# EAGLE design CanBus25mar (EAGLE 7.6.0)
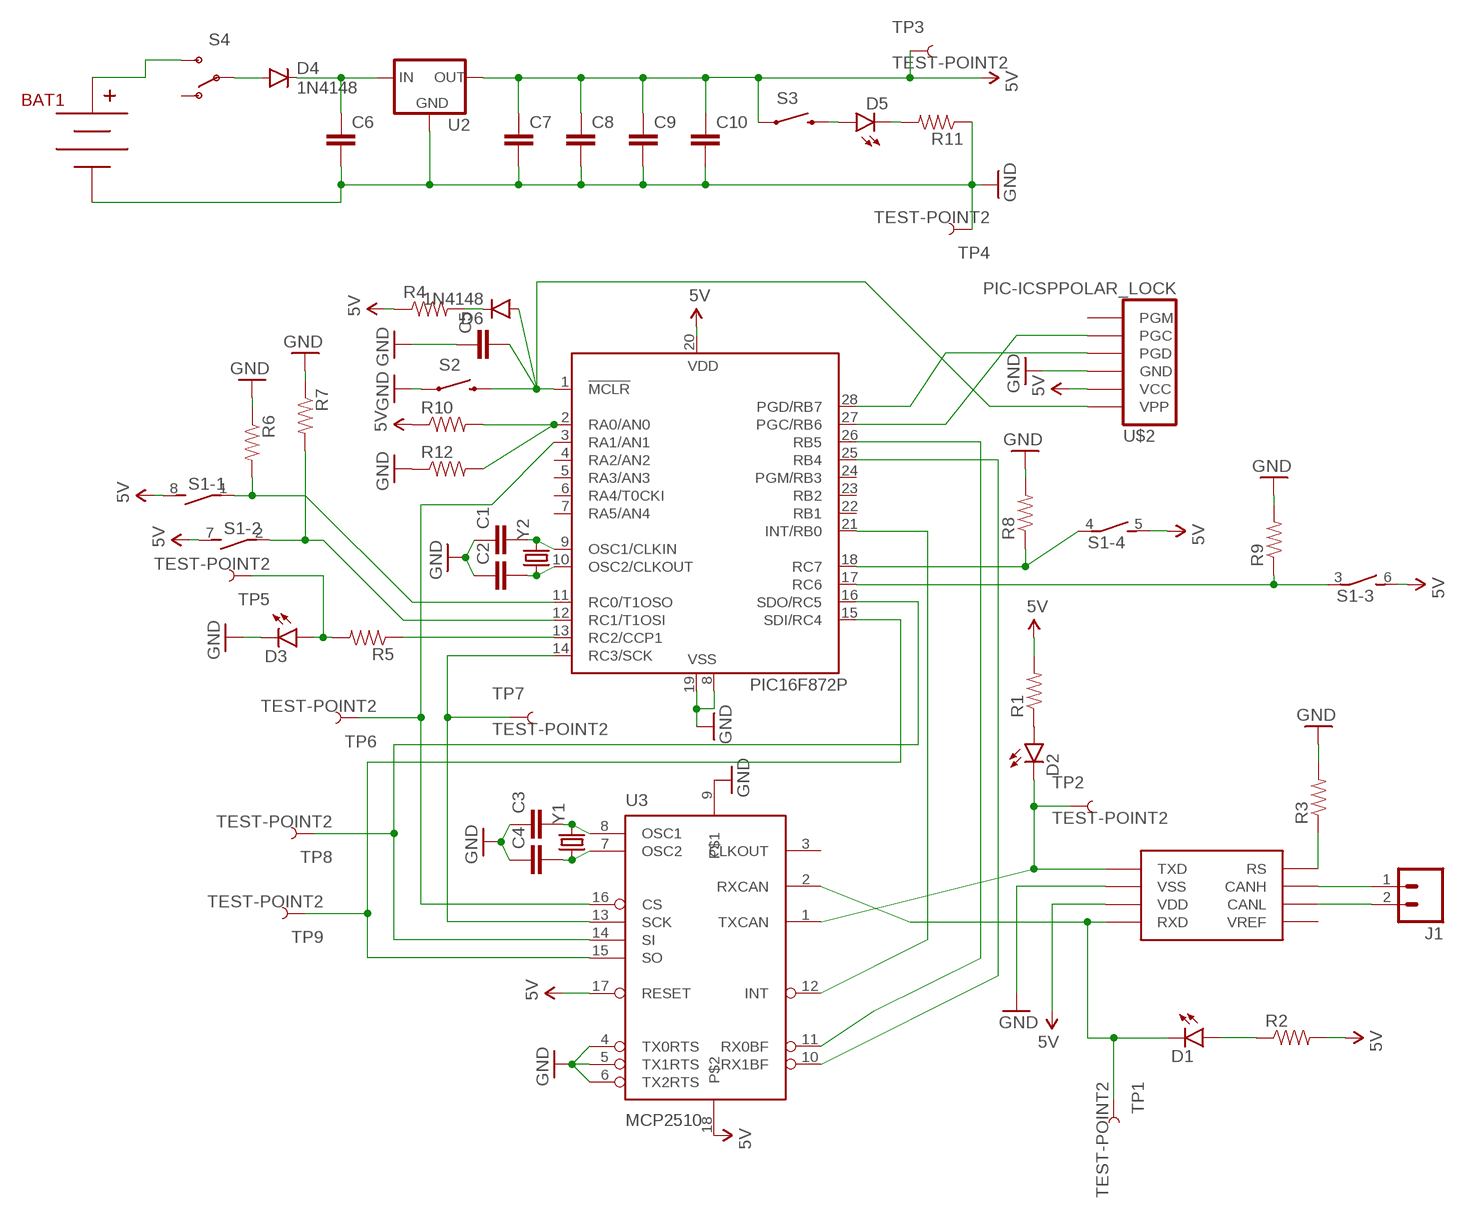
[diagram p0: schematic, sheet 1]

## Parts
BAT1  BC9VPC  [BC9VPC]
C1  CAPPTH  [CAP-PTH-SMALL]
C2  CAPPTH  [CAP-PTH-SMALL]
C3  CAPPTH  [CAP-PTH-SMALL]
C4  CAPPTH  [CAP-PTH-SMALL]
C5  CAPPTH  [CAP-PTH-SMALL]
C6  CAPPTH  [CAP-PTH-SMALL]
C7  CAPPTH  [CAP-PTH-SMALL]
C8  CAPPTH  [CAP-PTH-SMALL]
C9  CAPPTH  [CAP-PTH-SMALL]
C10  CAPPTH  [CAP-PTH-SMALL]
D1  LED5MM  [LED5MM]
D2  LED5MM  [LED5MM]
D3  LED5MM  [LED5MM]
D4  1N4148  DIODEKIT  [DIODE-1N4148-KIT]
D5  LED5MM  [LED5MM]
D6  1N4148  DIODEKIT  [DIODE-1N4148-KIT]
IC1  PIC16F872P  [DIL28-3]
J1  M02PTH  [1X02]
R1  RESISTOREZ  [AXIAL-0.3EZ]
R2  RESISTOREZ  [AXIAL-0.3EZ]
R3  RESISTOREZ  [AXIAL-0.3EZ]
R4  RESISTOREZ  [AXIAL-0.3EZ]
R5  RESISTOREZ  [AXIAL-0.3EZ]
R6  RESISTOREZ  [AXIAL-0.3EZ]
R7  RESISTOREZ  [AXIAL-0.3EZ]
R8  RESISTOREZ  [AXIAL-0.3EZ]
R9  RESISTOREZ  [AXIAL-0.3EZ]
R10  RESISTOREZ  [AXIAL-0.3EZ]
R11  RESISTOREZ  [AXIAL-0.3EZ]
R12  RESISTORAXIAL-0.3  [AXIAL-0.3]
S1  DIP04S  [DIP04S]
S2  SWITCH-MOMENTARY-2PTH  [TACTILE-PTH]
S3  SWITCH-MOMENTARY-2PTH  [TACTILE-PTH]
S4  SWITCH-SPDTKIT  [SWITCH-SPDT_KIT]
TP1  TEST-POINT2  [PAD.02X.02]
TP2  TEST-POINT2  [PAD.02X.02]
TP3  TEST-POINT2  [PAD.02X.02]
TP4  TEST-POINT2  [PAD.02X.02]
TP5  TEST-POINT2  [PAD.02X.02]
TP6  TEST-POINT2  [PAD.02X.02]
TP7  TEST-POINT2  [PAD.02X.02]
TP8  TEST-POINT2  [PAD.02X.02]
TP9  TEST-POINT2  [PAD.02X.02]
U2  V_REG_78XXSIDE  [78XXL]
U3  MCP2510  [DIL18]
U$1  MCP2551  [MCP2551]
U$2  PIC-ICSPPOLAR_LOCK  [MOLEX-1X6_LOCK]
Y1  CRYSTALHC49UV  [HC49U-V]
Y2  CRYSTALHC49UV  [HC49U-V]

## Nets
5V: C7.1 C8.1 C9.1 C10.1 IC1.20(VDD) R1.P$2 R2.P$2 R4.P$1 R10.P$1 S1.5 S1.6 S1.7 S1.8 S3.1 TP3.P$1 U2.OUT U3.17(RESET) U3.18 U$1.VDD U$2.5(VCC)
GND: BAT1.V- C1.1 C2.1 C3.1 C4.1 C5.1 C6.2 C7.2 C8.2 C9.2 C10.2 D3.K(C) IC1.8(VSS) IC1.19(VSS) R3.P$2 R6.P$1 R7.P$1 R8.P$2 R9.P$2 R11.P$1 R12.P$1 S2.1 TP4.P$1 U2.GND U3.4(TX0RTS) U3.5(TX1RTS) U3.6(TX2RTS) U3.9 U$1.VSS U$2.4(GND)
N$1: D1.K(C) TP1.P$1 U3.2(RXCAN) U$1.RXD
N$2: D2.K(C) TP2.P$1 U3.1(TXCAN) U$1.TXD
N$3: D2.A R1.P$1
N$4: D1.A R2.P$1
N$5: IC1.21(INT/RB0) U3.12(INT)
N$6: IC1.26(RB5) U3.11(RX0BF)
N$7: IC1.25(RB4) U3.10(RX1BF)
N$8: IC1.11(RC0/T1OSO) R6.P$2 S1.1
N$9: R3.P$1 U$1.RS
N$10: IC1.2(RA0/AN0) R10.P$2 R12.P$2
N$11: C3.2 U3.8(OSC1) Y1.2
N$12: C4.2 U3.7(OSC2) Y1.1
N$13: C1.2 IC1.9(OSC1/CLKIN) Y2.2
N$14: C2.2 IC1.10(OSC2/CLKOUT) Y2.1
N$15: IC1.14(RC3/SCK) TP7.P$1 U3.13(SCK)
N$16: IC1.16(SDO/RC5) TP8.P$1 U3.14(SI)
N$17: IC1.15(SDI/RC4) TP9.P$1 U3.15(SO)
N$18: IC1.3(RA1/AN1) TP6.P$1 U3.16(CS)
N$19: C5.2 D6.A IC1.1(!MCLR!) S2.3 U$2.6(VPP)
N$20: IC1.13(RC2/CCP1) R5.P$1
N$21: D3.A R5.P$2 TP5.P$1
N$22: IC1.27(PGC/RB6) U$2.2(PGC)
N$23: IC1.12(RC1/T1OSI) R7.P$2 S1.2
N$24: IC1.17(RC6) R9.P$1 S1.3
N$25: IC1.18(RC7) R8.P$1 S1.4
N$26: BAT1.V+ S4.3(S)
N$27: C6.1 D4.C U2.IN
N$28: D5.K(C) R11.P$2
N$29: D4.A S4.2(P)
N$30: D5.A S3.3
N$31: J1.1 U$1.CANH
N$32: J1.2 U$1.CANL
N$33: IC1.28(PGD/RB7) U$2.3(PGD)
N$34: D6.C R4.P$2
Unconnected: IC1.4(RA2/AN2) IC1.5(RA3/AN3) IC1.6(RA4/T0CKI) IC1.7(RA5/AN4) IC1.22(RB1) IC1.23(RB2) IC1.24(PGM/RB3) S4.1(O) U3.3(CLKOUT) U$1.VREF U$2.1(PGM)

## Library data of the parts
BAT1 = SparkFun-Connectors:BC9VPC: 9V board-mount battery cradle; PROD_ID: BATT-10855
C1-C10 = SparkFun-Passives:CAP: Capacitor Standard 0603 ceramic capacitor, and 0.1" leaded capacitor.
D1-D3 D5 = SparkFun-LED:LED: LEDs Standard schematic elements and footprints for 5mm, 3mm, 1206, and 0603 sized LEDs. 5mm - Spark Fun Electronics SKU : COM-00529 (and others)
D4 D6 = SparkFun-DiscreteSemi:DIODE: Diode These are standard reverse protection diodes and small signal diodes. SMA package can handle up to about 1A. SOD-323 can handle about 200mA. What the SOD-323 package when ordering, there are some mfgs out there that are 5-pin packages.
IC1 = microchip:PIC16*872: MICROCONTROLLER flash type; MF: MICROCHIP; MPN: PIC16F872-I/SP; OC_FARNELL: 9761012; OC_NEWARK: 12C1945
J1 = SparkFun-Connectors:M02: Standard 2-pin 0.1" header. Use with - straight break away headers ( PRT-00116) - right angle break away headers (PRT-00553) - swiss pins (PRT-00743) - machine pins (PRT-00117) - female headers (PRT-00115) Molex polarized connector foot print use with: PRT-08233 with associated crimp pins and housings. 2.54_SCREWTERM for use with PRT-10571. 3.5mm Screw Terminal footprints for PRT-08084 5mm Screw Terminal footprints for use with PRT-08432
R1-R11 = SparkFun-Passives:RESISTOR: Resistor Basic schematic elements and footprints for 0603, 1206, and PTH resistors.
R12 = SparkFun-Resistors:RESISTOR: Resistor Basic schematic elements and footprints for 0603, 1206, and PTH resistors.
S1 = switch-dil:DIP04S: DIL/CODE SWITCH; OC_FARNELL: unknown; OC_NEWARK: unknown
S2 S3 = SparkFun-Electromechanical:SWITCH-MOMENTARY-2: Various NO switches- pushbuttons, reed, etc; PROD_ID: SWCH-08441
S4 = SparkFun-Electromechanical:SWITCH-SPDT: SPDT Switch Simple slide switch, Spark Fun Electronics SKU : COM-00102 DPDT SMT slide switch, AYZ0202, SWCH-08179; PROD_ID: SWCH-08261
TP1-TP9 = SparkFun-Passives:TEST-POINT: Bare copper test points for troubleshooting or ICT
U2 = SparkFun-PowerIC:V_REG_78XX: Voltage Regulator Standard 78xx regulator. IGO (Input Ground Output). Spark Fun Electronics SKU : COM-00107
U3 = SparkFun-DigitalICfixed:MCP2510: CAN controller with SPI interface to any MCU. Original design by Microchip.
U$1 = mylibrary:MCP2551
U$2 = SparkFun-Connectors:PIC-ICSP: ISCP Programming connector for UAV, UBW Kit, etc.
Y1 Y2 = SparkFun-FreqCtrl:CRYSTAL: Various standard crystals. Proven footprints.

## Board
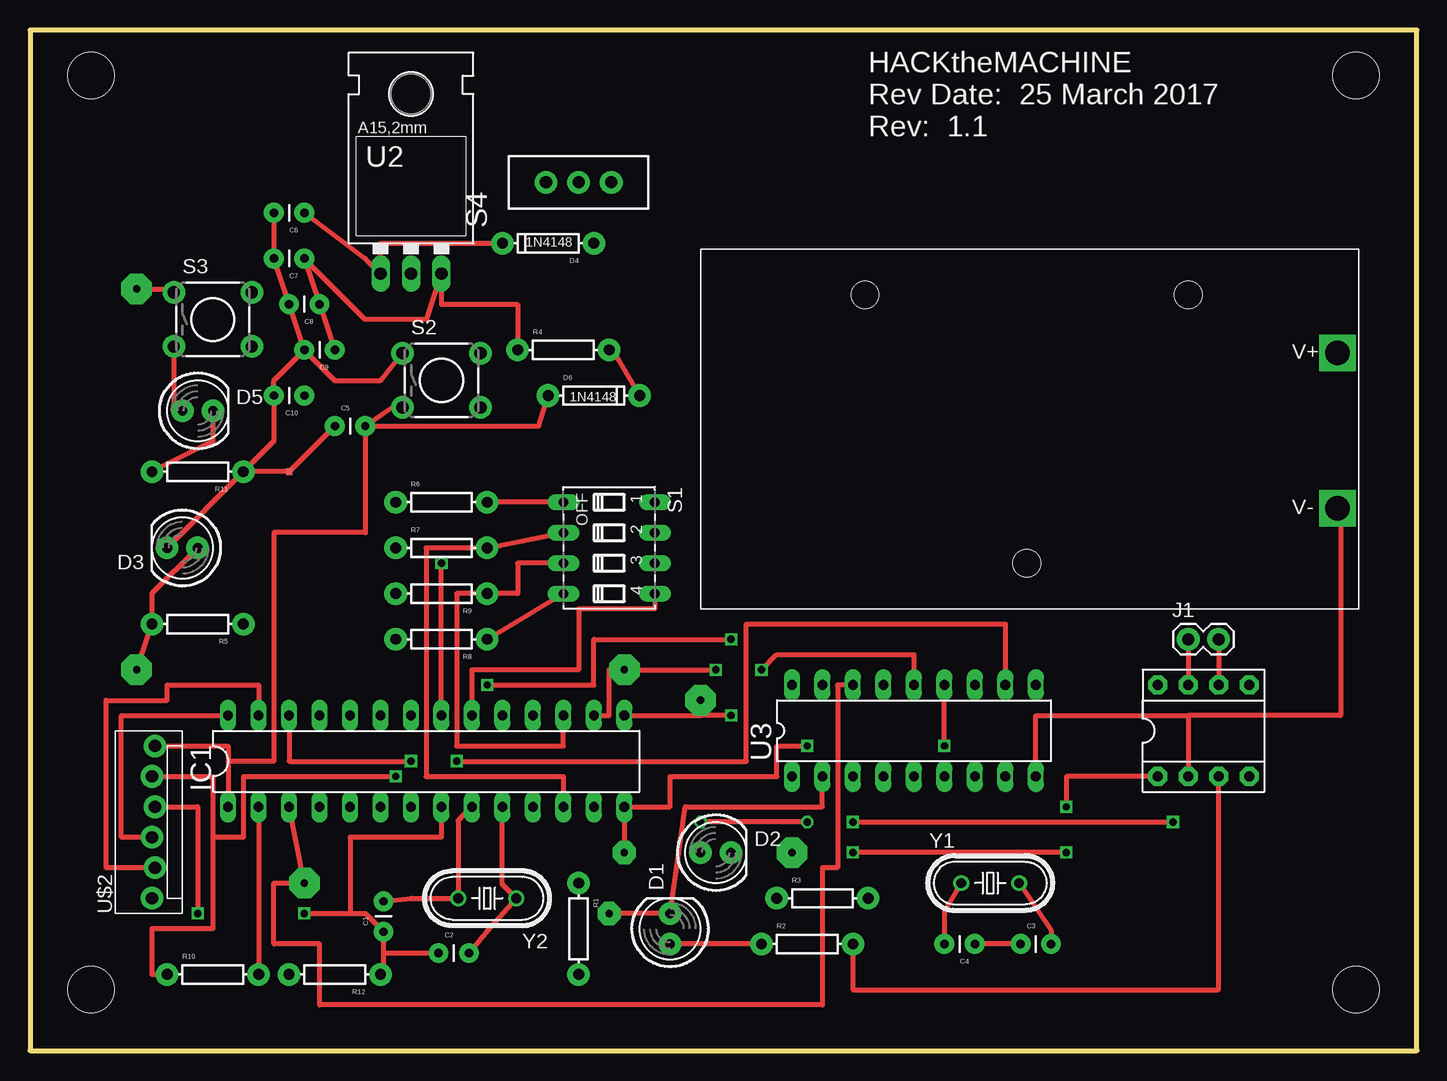
[diagram p1: board, top side]
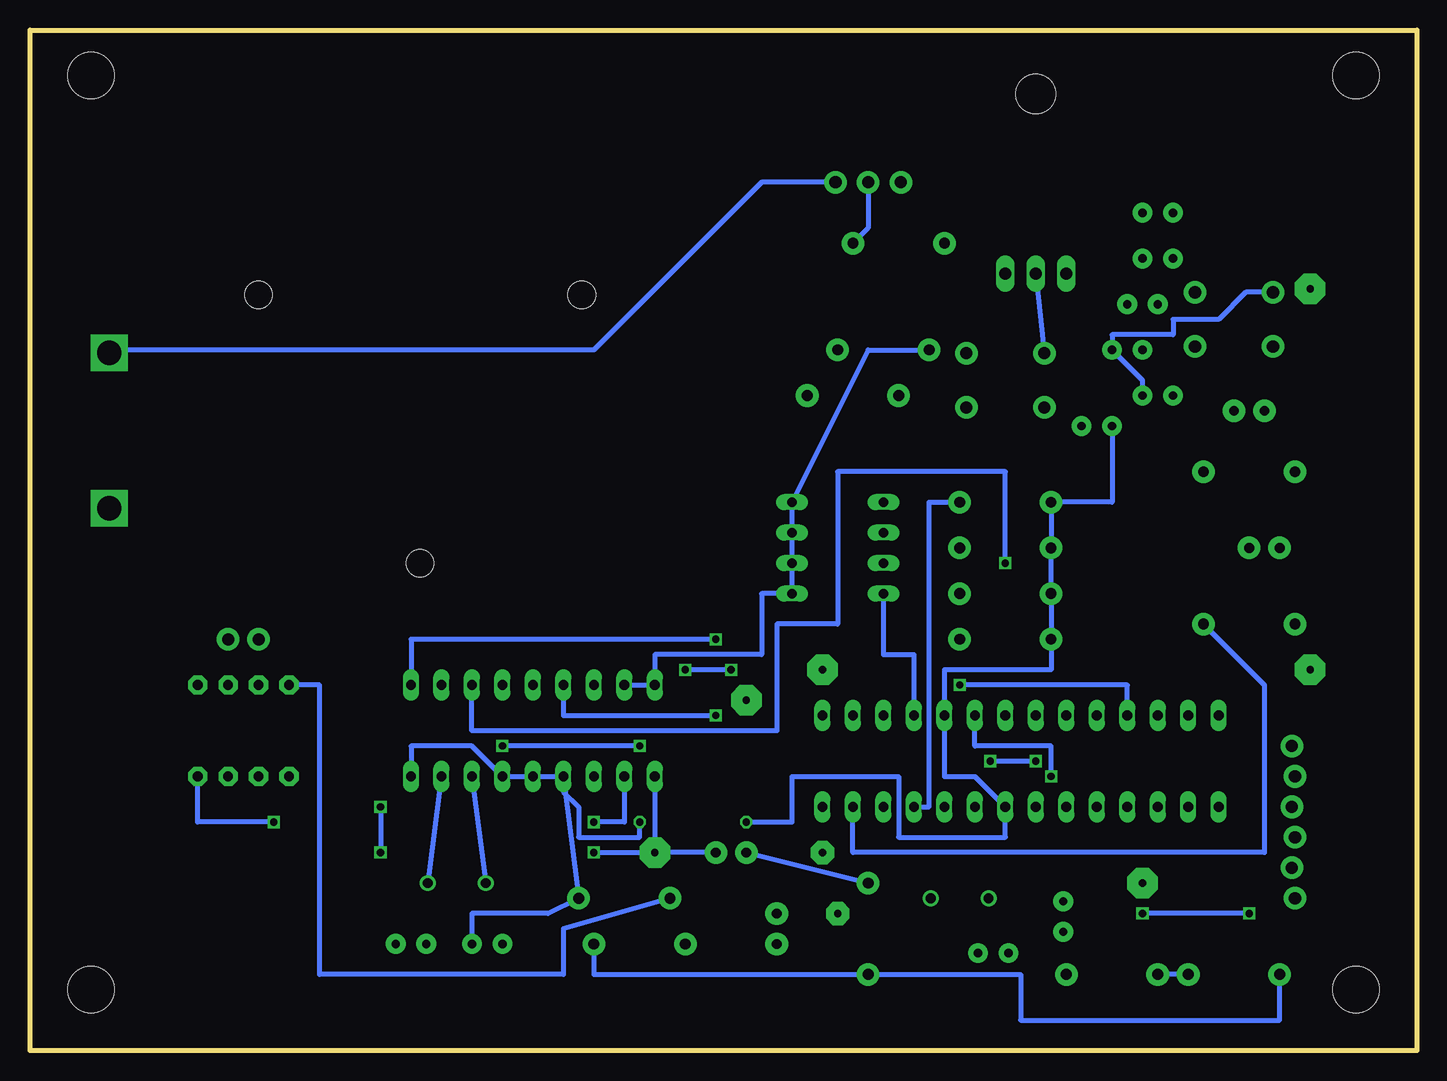
[diagram p2: board, bottom side, seen from below]

Size 115.57 x 85.09 mm. Coordinates in mm from the lower left corner, seen from the top.
Outline: 0,0 115.57,0 115.57,85.09 0,85.09 0,0
Copper layers (1*16): Top 0.035mm / dielectric 1.5mm / Bottom 0.035mm
Design rules "default": minimum track width 10mil, minimum drill 24mil, track to track 8mil, track to pad 8mil, pad to pad 8mil, via to via 8mil, smd to smd 8mil, copper to edge 40mil, drill to drill 8mil, minimum pad ring 10mil, minimum via ring 8mil, stop-mask expansion 4mil, vias tented up to drill 0mil, thermal gap 10mil
Holes 3.86 mm at 5.08,5.08 110.49,5.08 110.49,81.28 5.08,81.28

### Footprints (pad centres in the part's own frame; a part is rotated, then mirrored left to right if it is on the bottom)
BC9VPC = drill 2.032 square: V+ 53.086,21.336; V- 53.086,8.382 | hole 2.286: 27.178,3.81; 13.716,26.162; 40.64,26.162
CAP-PTH-SMALL = drill 0.7 pad 1.651: 1 0,0; 2 2.54,0
LED5MM = drill 0.813 pad 1.88: A -1.27,0; K 1.27,0
DIODE-1N4148-KIT = drill 0.9 pad 1.88: A -3.81,0; C 3.81,0
DIL28-3 = drill 0.813 long: 1 -16.51,-3.81; 2 -13.97,-3.81; 3 -11.43,-3.81; 4 -8.89,-3.81; 5 -6.35,-3.81; 6 -3.81,-3.81; 7 -1.27,-3.81; 8 1.27,-3.81; 9 3.81,-3.81; 10 6.35,-3.81; 11 8.89,-3.81; 12 11.43,-3.81; 13 13.97,-3.81; 14 16.51,-3.81; 15 16.51,3.81; 16 13.97,3.81; 17 11.43,3.81; 18 8.89,3.81; 19 6.35,3.81; 20 3.81,3.81; 21 1.27,3.81; 22 -1.27,3.81; 23 -3.81,3.81; 24 -6.35,3.81; 25 -8.89,3.81; 26 -11.43,3.81; 27 -13.97,3.81; 28 -16.51,3.81
1X02 = drill 1.016 pad 1.88: 1 0,0; 2 2.54,0
AXIAL-0.3EZ = drill 0.9 pad 1.88: P$1 -3.81,0; P$2 3.81,0
AXIAL-0.3 = drill 0.9 pad 1.88: P$1 -3.81,0; P$2 3.81,0
DIP04S = drill 0.813 long: 1 -3.81,-3.81; 2 -1.27,-3.81; 3 1.27,-3.81; 4 3.81,-3.81; 5 3.81,3.81; 6 1.27,3.81; 7 -1.27,3.81; 8 -3.81,3.81
TACTILE-PTH = drill 1.016 pad 1.88: 1 -3.251,2.261; 2 3.251,2.261; 3 -3.251,-2.261; 4 3.251,-2.261
SWITCH-SPDT_KIT = drill 1.016 pad 1.88: 1 0,2.718; 2 0,0; 3 0,-2.718
PAD.02X.02 = smd 0.508 x 0.508: P$1 0,0
78XXL = drill 1.016 long: GND 0,-3.81; IN -2.54,-3.81; OUT 2.54,-3.81 | hole 3.302: 0,11.176
DIL18 = drill 0.813 long: 1 -10.16,-3.81; 2 -7.62,-3.81; 3 -5.08,-3.81; 4 -2.54,-3.81; 5 0,-3.81; 6 2.54,-3.81; 7 5.08,-3.81; 8 7.62,-3.81; 9 10.16,-3.81; 10 10.16,3.81; 11 7.62,3.81; 12 5.08,3.81; 13 2.54,3.81; 14 0,3.81; 15 -2.54,3.81; 16 -5.08,3.81; 17 -7.62,3.81; 18 -10.16,3.81
MCP2551 = drill 0.813 pad 1.6 octagon: CANH -1.27,3.81; CANL 1.27,3.81; RS -3.81,3.81; RXD 3.81,-3.81; TXD -3.81,-3.81; VDD 1.27,-3.81; VREF 3.81,3.81; VSS -1.27,-3.81
MOLEX-1X6_LOCK = drill 1.016 pad 1.88: 1 0,0; 2 2.54,-0.254; 3 5.08,0; 4 7.62,-0.254; 5 10.16,0; 6 12.7,-0.254
HC49U-V = drill 0.813: 1 -2.413,0; 2 2.413,0

### Placement (x,y rotation side)
BAT1  55.88,36.83 0 top
C1  29.46,9.91 90 top
C2  34.04,8.13 0 top
C3  82.55,8.89 0 top
C4  78.74,8.89 180 top
C5  25.4,52.07 0 top
C6  22.86,69.85 180 top
C7  22.86,66.04 180 top
C8  24.13,62.23 180 top
C9  25.4,58.42 180 top
C10  22.86,54.61 180 top
D1  53.34,10.16 90 top
D2  57.15,16.51 0 top
D3  12.7,41.91 180 top
D4  43.18,67.31 180 top
D5  13.97,53.34 0 top
D6  46.99,54.61 0 top
IC1  33.02,24.13 0 top
J1  96.52,34.29 0 top
R1  45.72,10.16 270 top
R2  64.77,8.89 0 top
R3  66.04,12.7 0 top
R4  44.45,58.42 0 top
R5  13.97,35.56 180 top
R6  34.29,45.72 0 top
R7  34.29,41.91 0 top
R8  34.29,34.29 180 top
R9  34.29,38.1 180 top
R10  15.24,6.35 0 top
R11  13.97,48.26 180 top
R12  25.4,6.35 180 top
S1  48.26,41.91 270 top
S2  34.29,55.88 0 top
S3  15.24,60.96 0 top
S4  45.72,72.39 90 top
TP1  48.26,11.43 90 top
TP2  63.5,16.51 0 top
TP3  8.89,63.5 0 top
TP4  21.59,48.26 0 top
TP5  8.89,31.75 0 top
TP6  22.86,13.97 0 top
TP7  49.53,16.51 0 top
TP8  49.53,31.75 0 top
TP9  55.88,29.21 180 top
U2  31.75,68.58 0 top
U3  73.66,26.67 0 top
U$1  97.79,26.67 0 top
U$2  10.16,12.7 90 top
Y1  80.01,13.97 0 top
Y2  38.1,12.7 180 top

### Tracks (layer width: path | path; a pad name or v marks a point on that pad's centre or on a via)
5V  (via drill 0.6, 0.6 pad 2.54)
  Top 0.406: C9.1 C8.1 C7.1 27.94,60.96 33.02,60.96 U2.OUT 34.29,62.23 40.64,62.23 R4.P$1 | TP3.P$1 11.71,63.5 S3.1 | U$2.5 15.24,22.86 15.24,17.78 | 15.24,17.78 15.24,10.16 10.16,10.16 10.16,6.35 R10.P$1 | R2.P$2 68.58,5.08 99.06,5.08 U$1.VDD | 15.24,17.78 17.78,17.78 17.78,22.86 v30.48,22.86 | S1.5 52.07,36.83 45.72,36.83 45.72,31.75 36.83,31.75 IC1.20
  Bottom 0.406: C10.1 22.86,55.88 C9.1 25.4,59.69 20.32,59.69 20.32,60.96 16.51,60.96 14.25,63.22 S3.1 | R4.P$1 45.72,58.42 S1.8 S1.7 S1.6 S1.5 54.61,38.1 54.61,33.02 63.5,33.02 U3.18 U3.17 | R10.P$1 11.43,2.54 33.02,2.54 33.02,6.35 R1.P$2 68.58,6.35 R2.P$2 | v30.48,22.86 30.48,25.4 36.83,25.4 IC1.20
  other vias: 8.89,63.5
GND  (via drill 0.6, 0.6 pad 0.25)
  Top 0.406: C6.2 C7.2 C8.2 C9.2 | C9.2 20.32,55.88 C10.2 20.32,50.8 R11.P$1 | R11.P$1 TP4.P$1 C5.1 | R11.P$1 D3.K | C3.1 C4.1 | U$2.4 13.97,20.32 v13.97,11.43 | v22.86,11.43 26.67,11.43 | 26.67,11.43 27.94,11.43 C1.1 29.46,8.13 | C9.2 25.4,55.88 29.21,55.88 S2.1 | BAT1.V- arc-90 109.22,44.96 109.22,27.94 96.52,27.94 | 96.52,27.94 U$1.VSS | U3.9 83.82,27.94 96.52,27.94 | R12.P$1 29.46,6.35 29.46,8.13 | C2.1 29.46,8.13 | IC1.8 34.29,17.78 26.67,17.78 26.67,11.43 | v64.77,19.05 v55.88,19.05
  Bottom 0.406: v13.97,11.43 v22.86,11.43 | U2.GND S2.1 | C5.1 25.4,45.72 R6.P$1 R7.P$1 R9.P$2 R8.P$2 30.48,31.75 39.37,31.75 IC1.19 39.37,22.86 36.83,22.86 IC1.8 34.29,17.78 43.18,17.78 43.18,22.86 52.07,22.86 52.07,19.05 v55.88,19.05 | U3.4 R3.P$2 72.39,11.43 78.74,11.43 C4.1 | U3.4 U3.5 U3.6 78.74,25.4 83.82,25.4 U3.9 | U3.4 71.12,21.59 69.85,20.32 69.85,17.78 64.77,17.78 v64.77,19.05
N$1  (via drill 0.6, 0.6 pad 1.93)
  Top 0.406: U3.2 66.04,20.32 54.61,20.32 D1.K TP1.P$1 | v68.58,19.05 v95.25,19.05
  Bottom 0.406: U3.2 66.04,19.05 v68.58,19.05 | v95.25,19.05 101.6,19.05 U$1.RXD
  other vias: 48.26,11.43
N$2  (via drill 0.6, 0.6 pad 2.54)
  Top 0.406: U$1.TXD 86.36,22.86 v86.36,20.32 | v86.36,16.51 v68.58,16.51
  Bottom 0.406: D2.K TP2.P$1 | U3.1 TP2.P$1 | v86.36,20.32 v86.36,16.51 | v68.58,16.51 TP2.P$1
  other vias: 63.5,16.51
N$3
  Bottom 0.406: D2.A R1.P$1
N$4
  Top 0.406: R2.P$1 D1.A
N$5  (via drill 0.6)
  Top 0.406: IC1.21 v34.29,40.64
  Bottom 0.406: v34.29,40.64 34.29,48.26 48.26,48.26 48.26,35.56 53.34,35.56 53.34,26.67 78.74,26.67 U3.12
N$6  (via drill 0.6)
  Top 0.406: v35.56,24.13 59.69,24.13 59.69,35.56 81.28,35.56 U3.11 | IC1.26 21.59,24.13 v31.75,24.13
  Bottom 0.406: v31.75,24.13 v35.56,24.13
N$7  (via drill 0.6)
  Top 0.406: v38.1,30.48 46.99,30.48 46.99,34.29 v58.42,34.29
  Bottom 0.406: IC1.25 24.13,30.48 v38.1,30.48 | v58.42,34.29 83.82,34.29 U3.10
N$8
  Top 0.406: S1.1 R6.P$2
  Bottom 0.406: IC1.11 40.64,20.32 40.64,45.72 R6.P$2
N$9
  Bottom 0.406: R3.P$1 71.12,10.16 71.12,6.35 91.44,6.35 91.44,30.48 U$1.RS
N$10
  Top 0.406: IC1.2 R10.P$2
  Bottom 0.406: R10.P$2 R12.P$2
N$11
  Top 0.406: Y1.2 85.09,10.03 C3.2
  Bottom 0.406: U3.8 Y1.2
N$12
  Top 0.406: Y1.1 76.2,11.56 C4.2
  Bottom 0.406: U3.7 Y1.1
N$13
  Top 0.406: C1.2 31.75,12.7 Y2.2 35.69,19.18 IC1.9
N$14
  Top 0.406: IC1.10 39.37,13.84 Y2.1 38.35,10.29 C2.2
N$15  (via drill 0.6, 0.6 pad 1.93)
  Top 0.406: TP7.P$1 IC1.14 53.34,20.32 53.34,22.86 62.23,22.86 62.23,25.4 v64.77,25.4 | v76.2,25.4 U3.13
  Bottom 0.406: v64.77,25.4 v76.2,25.4
  other vias: 49.53,16.51
N$16  (via drill 0.6)
  Top 0.406: IC1.16 48.26,27.94 48.26,31.75 TP8.P$1 v57.15,31.75 | v60.96,31.75 62.23,33.02 73.66,33.02 U3.14
  Bottom 0.406: v57.15,31.75 v60.96,31.75
N$17  (via drill 0.6)
  Top 0.406: IC1.15 55.88,27.94 | v58.42,27.94 55.88,27.94 | 55.88,27.94 TP9.P$1
  Bottom 0.406: U3.15 71.12,27.94 v58.42,27.94
N$18
  Top 0.406: IC1.3 TP6.P$1 20.32,13.97 20.32,8.89 24.13,8.89 24.13,3.81 66.04,3.81 66.04,15.24 67.31,15.24 67.31,30.48 U3.16
N$19
  Top 0.406: C5.2 30.2,53.62 S2.3 | U$2.6 16.51,25.4 16.51,24.13 | 16.51,24.13 IC1.1 | C5.2 42.4,52.07 D6.A | C5.2 27.94,43.18 20.32,43.18 20.32,24.13 16.51,24.13
N$20
  Bottom 0.406: R5.P$1 12.7,30.48 12.7,16.51 46.99,16.51 IC1.13
N$21  (via drill 0.6 pad 2.54)
  Top 0.406: D3.A 10.16,38.1 R5.P$2 TP5.P$1
  other vias: 8.89,31.75
N$22
  Top 0.406: U$2.2 6.35,15.24 6.35,29.21 11.43,29.21 11.43,30.48 19.05,30.48 IC1.27
N$23
  Top 0.406: S1.2 R7.P$2 33.02,41.91 33.02,22.86 44.45,22.86 IC1.12
N$24
  Top 0.406: IC1.17 44.45,25.4 35.56,25.4 35.56,38.1 R9.P$1 40.64,38.1 40.64,40.64 S1.3
N$25
  Top 0.406: R8.P$1 S1.4
  Bottom 0.406: S1.4 44.45,33.02 41.91,33.02 IC1.18
N$26
  Bottom 0.406: S4.3 54.61,72.39 68.58,58.42 108.71,58.42 BAT1.V+
N$27
  Top 0.406: C6.1 27.94,66.04 U2.IN 29.21,67.31 D4.C
N$28
  Top 0.406: D5.K 15.24,50.8 R11.P$2
N$29
  Bottom 0.406: S4.2 45.72,68.58 D4.A
N$30
  Top 0.406: S3.3 11.99,54.05 D5.A
N$31
  Top 0.406: J1.1 U$1.CANH
N$32
  Top 0.406: J1.2 U$1.CANL
N$33
  Top 0.406: U$2.3 7.62,17.78 7.62,27.94 IC1.28
N$34
  Top 0.406: D6.C 49.04,57.64 R4.P$2
N$35  (via drill 0.6 pad 2.54)
  other vias: 22.86,13.97
N$37  (via drill 0.6 pad 2.54)
  other vias: 55.88,29.21
N$38  (via drill 0.6 pad 2.54)
  other vias: 49.53,31.75

### Text on the board
tPlace: HACKtheMACHINE / Rev Date: 25 March 2017 / Rev: 1.1